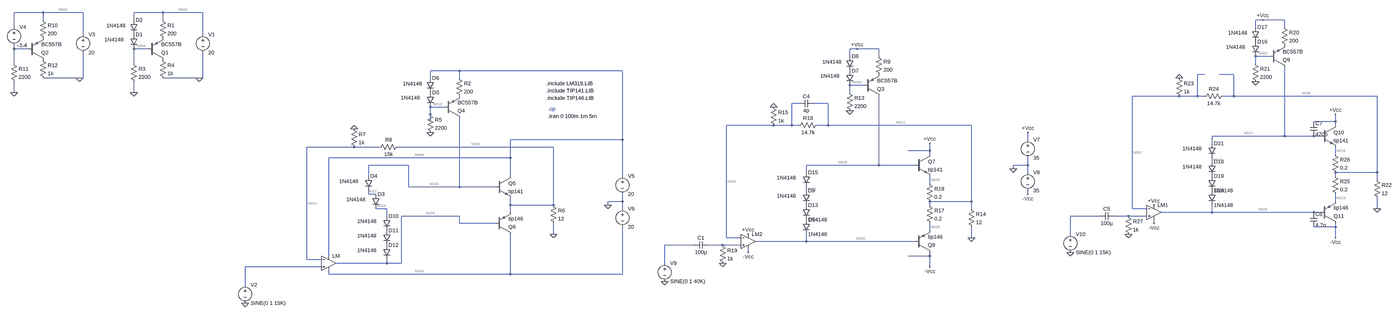
[diagram p0: schematic circuito_final.asc, whole sheet]
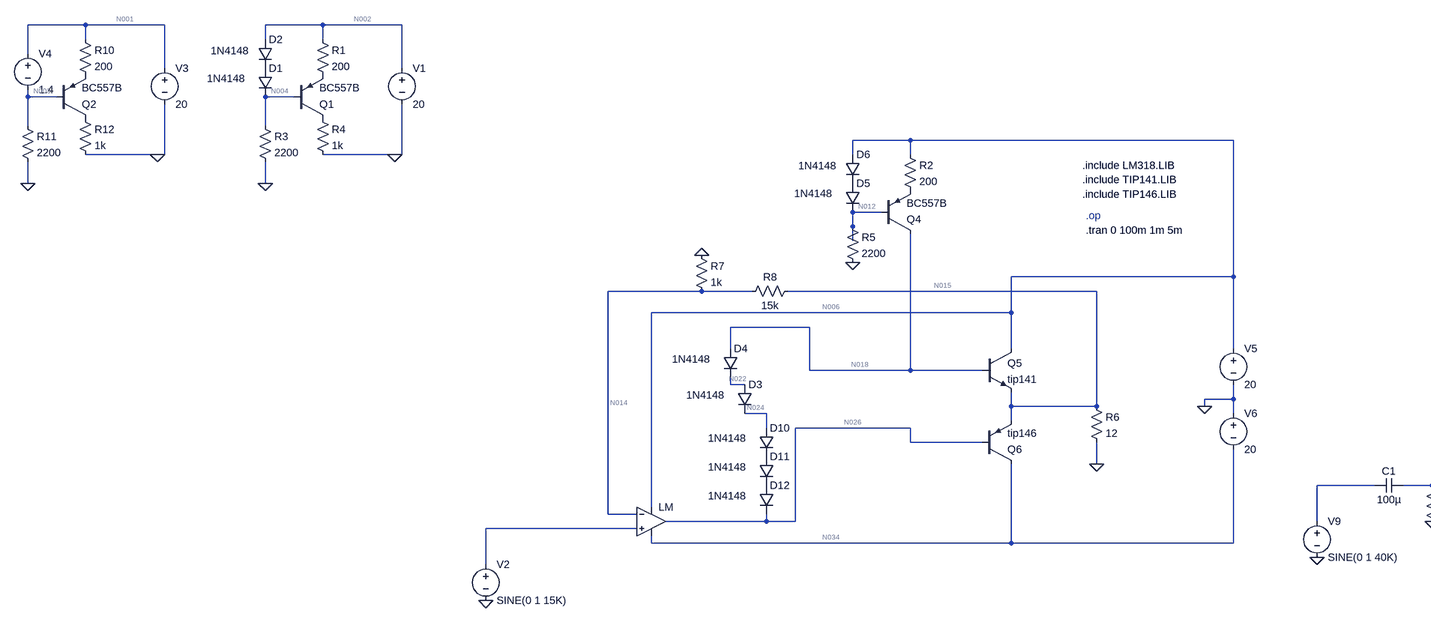
[diagram p1: schematic circuito_final.asc, part, row 1 of 1, column 1 of 2]
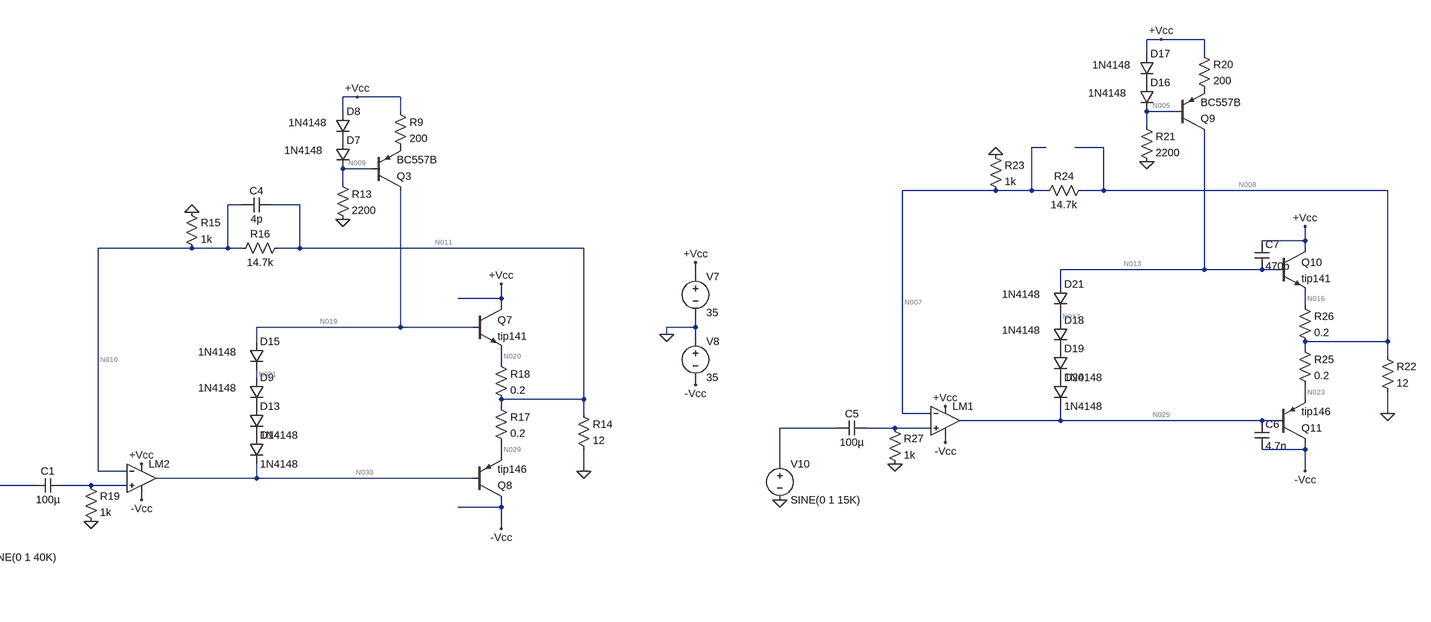
[diagram p2: schematic circuito_final.asc, part, row 1 of 1, column 2 of 2]
circuito_final.asc, the LTspice schematic file:
Version 4
SHEET 1 3348 680
WIRE -3168 -688 -3296 -688
WIRE -2992 -688 -3168 -688
WIRE -2640 -688 -2768 -688
WIRE -2464 -688 -2640 -688
WIRE -3168 -656 -3168 -688
WIRE -2768 -656 -2768 -688
WIRE -2640 -656 -2640 -688
WIRE 2768 -656 2736 -656
WIRE 2864 -656 2768 -656
WIRE -3296 -624 -3296 -688
WIRE 2736 -624 2736 -656
WIRE 2864 -624 2864 -656
WIRE -2992 -592 -2992 -688
WIRE -2464 -592 -2464 -688
WIRE -3296 -528 -3296 -544
WIRE -3232 -528 -3296 -528
WIRE -2704 -528 -2768 -528
WIRE 832 -528 800 -528
WIRE 928 -528 832 -528
WIRE 800 -496 800 -528
WIRE 928 -496 928 -528
WIRE 2800 -496 2736 -496
WIRE -3296 -464 -3296 -528
WIRE -2768 -464 -2768 -528
WIRE 2736 -464 2736 -496
WIRE -1072 -432 -1200 -432
WIRE -352 -432 -1072 -432
WIRE 2512 -416 2480 -416
WIRE 2640 -416 2576 -416
WIRE -3008 -400 -3168 -400
WIRE -2992 -400 -2992 -512
WIRE -2992 -400 -3008 -400
WIRE -2480 -400 -2640 -400
WIRE -2464 -400 -2464 -512
WIRE -2464 -400 -2480 -400
WIRE -1200 -400 -1200 -432
WIRE -1072 -400 -1072 -432
WIRE 864 -368 800 -368
WIRE -3296 -336 -3296 -384
WIRE -2768 -336 -2768 -384
WIRE 800 -336 800 -368
WIRE 2400 -320 2192 -320
WIRE 2480 -320 2480 -416
WIRE 2480 -320 2400 -320
WIRE 2512 -320 2480 -320
WIRE 2640 -320 2640 -416
WIRE 2640 -320 2592 -320
WIRE 3280 -320 2640 -320
WIRE 576 -288 544 -288
WIRE 704 -288 640 -288
WIRE -1136 -272 -1200 -272
WIRE -1200 -240 -1200 -272
WIRE -1200 -208 -1200 -240
WIRE 3088 -208 3088 -240
WIRE 3088 -208 2992 -208
WIRE 464 -192 256 -192
WIRE 544 -192 544 -288
WIRE 544 -192 464 -192
WIRE 576 -192 544 -192
WIRE 704 -192 704 -288
WIRE 704 -192 656 -192
WIRE 1344 -192 704 -192
WIRE 3088 -192 3088 -208
WIRE 2864 -144 2864 -448
WIRE 2864 -144 2544 -144
WIRE 2992 -144 2864 -144
WIRE 3024 -144 2992 -144
WIRE -352 -128 -352 -432
WIRE -352 -128 -848 -128
WIRE 1664 -128 1664 -160
WIRE 2544 -112 2544 -144
WIRE -1536 -96 -1744 -96
WIRE -1424 -96 -1536 -96
WIRE -656 -96 -1344 -96
WIRE 1152 -80 1152 -112
WIRE 1152 -80 1056 -80
WIRE 1152 -64 1152 -80
WIRE 3088 -64 3088 -96
WIRE -848 -48 -848 -128
WIRE -848 -48 -1648 -48
WIRE 2544 -32 2544 -48
WIRE -1296 -16 -1472 -16
WIRE 928 -16 928 -320
WIRE 928 -16 608 -16
WIRE 1088 -16 928 -16
WIRE 1664 -16 1664 -48
WIRE 1664 -16 1600 -16
WIRE 1600 0 1600 -16
WIRE 608 16 608 -16
WIRE 1664 16 1664 -16
WIRE 3280 16 3280 -320
WIRE 3280 16 3088 16
WIRE -1472 32 -1472 -16
WIRE -848 32 -848 -48
WIRE -352 32 -352 -128
WIRE 3088 32 3088 16
WIRE 3280 48 3280 16
WIRE 1152 64 1152 32
WIRE -1296 80 -1296 -16
WIRE -1072 80 -1072 -224
WIRE -1072 80 -1296 80
WIRE -912 80 -1072 80
WIRE 608 96 608 80
WIRE -1472 112 -1472 96
WIRE -1440 112 -1472 112
WIRE 1664 112 1664 96
WIRE -352 144 -352 112
WIRE -352 144 -416 144
WIRE 1344 144 1344 -192
WIRE 1344 144 1152 144
WIRE 3088 144 3088 112
WIRE -848 160 -848 128
WIRE -656 160 -656 -96
WIRE -656 160 -848 160
WIRE -416 160 -416 144
WIRE 1152 160 1152 144
WIRE -1392 176 -1440 176
WIRE -352 176 -352 144
WIRE 1344 176 1344 144
WIRE 2192 176 2192 -320
WIRE 2256 176 2192 176
WIRE 3280 176 3280 128
WIRE -848 192 -848 160
WIRE 2544 192 2544 160
WIRE 2544 192 2320 192
WIRE 2992 192 2544 192
WIRE 3024 192 2992 192
WIRE -1392 208 -1392 176
WIRE -1072 208 -1328 208
WIRE 2048 208 1920 208
WIRE 2176 208 2112 208
WIRE 2256 208 2176 208
WIRE -1072 240 -1072 208
WIRE -912 240 -1072 240
WIRE 2288 240 2288 224
WIRE 3088 256 3088 240
WIRE 3088 256 2992 256
WIRE 1152 272 1152 240
WIRE -656 288 -656 240
WIRE 1920 288 1920 208
WIRE 256 304 256 -192
WIRE 320 304 256 304
WIRE 1344 304 1344 256
WIRE 3088 304 3088 256
WIRE 608 320 608 288
WIRE 608 320 384 320
WIRE 1088 320 608 320
WIRE 112 336 -16 336
WIRE 240 336 176 336
WIRE 320 336 240 336
WIRE 352 368 352 352
WIRE -1648 384 -1648 -48
WIRE 1152 384 1152 368
WIRE 1152 384 1056 384
WIRE -1744 400 -1744 -96
WIRE -1680 400 -1744 400
WIRE -1392 416 -1392 400
WIRE -1392 416 -1616 416
WIRE -1328 416 -1328 208
WIRE -1328 416 -1392 416
WIRE -16 416 -16 336
WIRE -1680 432 -2016 432
WIRE 1152 432 1152 384
WIRE -1648 464 -1648 448
WIRE -848 464 -848 288
WIRE -848 464 -1648 464
WIRE -352 464 -352 256
WIRE -352 464 -848 464
WIRE -2016 512 -2016 432
FLAG -1200 -160 0
FLAG -416 160 0
FLAG -656 288 0
FLAG -2768 -336 0
FLAG -2480 -400 0
FLAG -1536 -176 0
FLAG -2016 592 0
FLAG -3296 -336 0
FLAG -3008 -400 0
FLAG 1600 0 0
FLAG 1664 -160 +Vcc
FLAG 1664 112 -Vcc
FLAG 2736 -384 0
FLAG 3280 176 0
FLAG 2400 -400 0
FLAG 1920 368 0
FLAG 2768 -656 +Vcc
FLAG 2288 240 -Vcc
FLAG 3088 -240 +Vcc
FLAG 2288 160 +Vcc
FLAG 3088 304 -Vcc
FLAG 2176 288 0
FLAG 800 -256 0
FLAG 1344 304 0
FLAG 464 -272 0
FLAG -16 496 0
FLAG 832 -528 +Vcc
FLAG 352 368 -Vcc
FLAG 1152 -112 +Vcc
FLAG 352 288 +Vcc
FLAG 1152 432 -Vcc
FLAG 240 416 0
DATAFLAG -848 160 ""
DATAFLAG -848 160 ""
DATAFLAG -1056 80 ""
DATAFLAG -1040 240 ""
DATAFLAG 3280 -128 ""
DATAFLAG 2768 -144 ""
DATAFLAG 2800 192 ""
DATAFLAG 1344 0 ""
DATAFLAG 832 -16 ""
DATAFLAG 864 320 ""
SYMBOL diode -1216 -336 R0
WINDOW 3 -114 23 Left 2
SYMATTR Value 1N4148
SYMATTR InstName D5
SYMBOL diode -1216 -400 R0
WINDOW 3 -105 25 Left 2
SYMATTR Value 1N4148
SYMATTR InstName D6
SYMBOL res -1088 -416 R0
SYMATTR InstName R2
SYMATTR Value 200
SYMBOL res -1216 -256 R0
SYMATTR InstName R5
SYMATTR Value 2200
SYMBOL pnp -1136 -224 M180
SYMATTR InstName Q4
SYMATTR Value BC557B
SYMBOL npn -912 32 R0
SYMATTR InstName Q5
SYMATTR Value tip141
SYMATTR Prefix X
SYMBOL pnp -912 288 M180
SYMATTR InstName Q6
SYMATTR Value tip146
SYMATTR Prefix X
SYMBOL voltage -352 16 R0
WINDOW 123 0 0 Left 0
WINDOW 39 0 0 Left 0
SYMATTR InstName V5
SYMATTR Value 20
SYMBOL voltage -352 160 R0
WINDOW 123 0 0 Left 0
WINDOW 39 0 0 Left 0
SYMATTR InstName V6
SYMATTR Value 20
SYMBOL res -672 144 R0
SYMATTR InstName R6
SYMATTR Value 12
SYMBOL diode -1408 208 R0
WINDOW 3 -114 23 Left 2
SYMATTR Value 1N4148
SYMATTR InstName D10
SYMBOL diode -1408 272 R0
WINDOW 3 -114 23 Left 2
SYMATTR Value 1N4148
SYMATTR InstName D11
SYMBOL diode -1408 336 R0
WINDOW 3 -114 23 Left 2
SYMATTR Value 1N4148
SYMATTR InstName D12
SYMBOL diode -2784 -592 R0
WINDOW 3 -114 23 Left 2
SYMATTR Value 1N4148
SYMATTR InstName D1
SYMBOL diode -2784 -656 R0
WINDOW 3 -105 25 Left 2
SYMATTR Value 1N4148
SYMATTR InstName D2
SYMBOL res -2656 -672 R0
SYMATTR InstName R1
SYMATTR Value 200
SYMBOL res -2784 -480 R0
SYMATTR InstName R3
SYMATTR Value 2200
SYMBOL pnp -2704 -480 M180
SYMATTR InstName Q1
SYMATTR Value BC557B
SYMBOL voltage -2464 -608 R0
WINDOW 123 0 0 Left 0
WINDOW 39 0 0 Left 0
SYMATTR InstName V1
SYMATTR Value 20
SYMBOL res -2656 -496 R0
SYMATTR InstName R4
SYMATTR Value 1k
SYMBOL res -1552 -192 R0
SYMATTR InstName R7
SYMATTR Value 1k
SYMBOL res -1328 -112 R90
WINDOW 0 0 56 VBottom 2
WINDOW 3 32 56 VTop 2
SYMATTR InstName R8
SYMATTR Value 15k
SYMBOL voltage -2016 496 R0
WINDOW 123 0 0 Left 0
WINDOW 39 0 0 Left 0
SYMATTR InstName V2
SYMATTR Value SINE(0 1 15K)
SYMBOL diode -1456 112 R0
WINDOW 3 -114 23 Left 2
SYMATTR Value 1N4148
SYMATTR InstName D3
SYMBOL diode -1488 32 R0
WINDOW 3 -114 23 Left 2
SYMATTR Value 1N4148
SYMATTR InstName D4
SYMBOL res -3184 -672 R0
SYMATTR InstName R10
SYMATTR Value 200
SYMBOL res -3312 -480 R0
SYMATTR InstName R11
SYMATTR Value 2200
SYMBOL pnp -3232 -480 M180
SYMATTR InstName Q2
SYMATTR Value BC557B
SYMBOL voltage -2992 -608 R0
WINDOW 123 0 0 Left 0
WINDOW 39 0 0 Left 0
SYMATTR InstName V3
SYMATTR Value 20
SYMBOL res -3184 -496 R0
SYMATTR InstName R12
SYMATTR Value 1k
SYMBOL voltage -3296 -640 R0
WINDOW 123 0 0 Left 0
WINDOW 39 0 0 Left 0
SYMATTR InstName V4
SYMATTR Value 1.4
SYMBOL OpAmps\\UniversalOpAmp2 -1648 416 R0
SYMATTR InstName LM
SYMBOL voltage 1664 -144 R0
WINDOW 123 0 0 Left 0
WINDOW 39 0 0 Left 0
SYMATTR InstName V7
SYMATTR Value 35
SYMBOL voltage 1664 0 R0
WINDOW 123 0 0 Left 0
WINDOW 39 0 0 Left 0
SYMATTR InstName V8
SYMATTR Value 35
SYMBOL diode 2720 -560 R0
WINDOW 3 -114 23 Left 2
SYMATTR Value 1N4148
SYMATTR InstName D16
SYMBOL diode 2720 -624 R0
WINDOW 3 -105 25 Left 2
SYMATTR Value 1N4148
SYMATTR InstName D17
SYMBOL res 2848 -640 R0
SYMATTR InstName R20
SYMATTR Value 200
SYMBOL res 2720 -480 R0
SYMATTR InstName R21
SYMATTR Value 2200
SYMBOL pnp 2800 -448 M180
SYMATTR InstName Q9
SYMATTR Value BC557B
SYMBOL npn 3024 -192 R0
SYMATTR InstName Q10
SYMATTR Value tip141
SYMATTR Prefix X
SYMBOL pnp 3024 240 M180
SYMATTR InstName Q11
SYMATTR Value tip146
SYMATTR Prefix X
SYMBOL res 3264 32 R0
SYMATTR InstName R22
SYMATTR Value 12
SYMBOL diode 2528 -32 R0
WINDOW 3 -114 23 Left 2
SYMATTR Value 1N4148
SYMATTR InstName D18
SYMBOL diode 2528 32 R0
SYMATTR Value 1N4148
SYMATTR InstName D19
SYMBOL diode 2528 96 R0
SYMATTR Value 1N4148
SYMATTR InstName D20
SYMBOL res 2384 -416 R0
SYMATTR InstName R23
SYMATTR Value 1k
SYMBOL res 2608 -336 R90
WINDOW 0 0 56 VBottom 2
WINDOW 3 32 56 VTop 2
SYMATTR InstName R24
SYMATTR Value 14.7k
SYMBOL voltage 1920 272 R0
WINDOW 123 0 0 Left 0
WINDOW 39 0 0 Left 0
SYMATTR InstName V10
SYMATTR Value SINE(0 1 15K)
SYMBOL OpAmps\\UniversalOpAmp2 2288 192 R0
SYMATTR InstName LM1
SYMBOL diode 2528 -112 R0
WINDOW 3 -114 23 Left 2
SYMATTR Value 1N4148
SYMATTR InstName D21
SYMBOL res 3072 16 R0
SYMATTR InstName R25
SYMATTR Value 0.2
SYMBOL res 3072 -80 R0
SYMATTR InstName R26
SYMATTR Value 0.2
SYMBOL res 2160 192 R0
SYMATTR InstName R27
SYMATTR Value 1k
SYMBOL cap 2112 192 R90
WINDOW 0 0 32 VBottom 2
WINDOW 3 32 32 VTop 2
SYMATTR InstName C5
SYMATTR Value 100µ
SYMBOL cap 2976 192 R0
SYMATTR InstName C6
SYMATTR Value 4.7n
SYMBOL cap 2976 -208 R0
SYMATTR InstName C7
SYMATTR Value 470p
SYMBOL diode 784 -432 R0
WINDOW 3 -114 23 Left 2
SYMATTR Value 1N4148
SYMATTR InstName D7
SYMBOL diode 784 -496 R0
WINDOW 3 -105 25 Left 2
SYMATTR Value 1N4148
SYMATTR InstName D8
SYMBOL res 912 -512 R0
SYMATTR InstName R9
SYMATTR Value 200
SYMBOL res 784 -352 R0
SYMATTR InstName R13
SYMATTR Value 2200
SYMBOL pnp 864 -320 M180
SYMATTR InstName Q3
SYMATTR Value BC557B
SYMBOL npn 1088 -64 R0
SYMATTR InstName Q7
SYMATTR Value tip141
SYMATTR Prefix X
SYMBOL pnp 1088 368 M180
SYMATTR InstName Q8
SYMATTR Value tip146
SYMATTR Prefix X
SYMBOL res 1328 160 R0
SYMATTR InstName R14
SYMATTR Value 12
SYMBOL diode 592 96 R0
WINDOW 3 -114 23 Left 2
SYMATTR Value 1N4148
SYMATTR InstName D9
SYMBOL diode 592 160 R0
SYMATTR Value 1N4148
SYMATTR InstName D13
SYMBOL diode 592 224 R0
SYMATTR Value 1N4148
SYMATTR InstName D14
SYMBOL res 448 -288 R0
SYMATTR InstName R15
SYMATTR Value 1k
SYMBOL res 672 -208 R90
WINDOW 0 0 56 VBottom 2
WINDOW 3 32 56 VTop 2
SYMATTR InstName R16
SYMATTR Value 14.7k
SYMBOL voltage -16 400 R0
WINDOW 123 0 0 Left 0
WINDOW 39 0 0 Left 0
SYMATTR InstName V9
SYMATTR Value SINE(0 1 40K)
SYMBOL OpAmps\\UniversalOpAmp2 352 320 R0
SYMATTR InstName LM2
SYMBOL diode 592 16 R0
WINDOW 3 -114 23 Left 2
SYMATTR Value 1N4148
SYMATTR InstName D15
SYMBOL res 1136 144 R0
SYMATTR InstName R17
SYMATTR Value 0.2
SYMBOL res 1136 48 R0
SYMATTR InstName R18
SYMATTR Value 0.2
SYMBOL res 224 320 R0
SYMATTR InstName R19
SYMATTR Value 1k
SYMBOL cap 176 320 R90
WINDOW 0 0 32 VBottom 2
WINDOW 3 32 32 VTop 2
SYMATTR InstName C1
SYMATTR Value 100µ
SYMBOL cap 640 -304 R90
WINDOW 0 0 32 VBottom 2
WINDOW 3 32 32 VTop 2
SYMATTR InstName C4
SYMATTR Value 4p
TEXT -680 -232 Left 2 !.tran 0 100m 1m 5m
TEXT -688 -344 Left 2 !.include TIP141.LIB
TEXT -688 -312 Left 2 !.include TIP146.LIB
TEXT -688 -376 Left 2 !.include LM318.LIB
TEXT -680 -264 Left 2 ;.op

The netlist it stands for:
* circuito_final.asc
D5 P001 N012 1N4148
D6 N006 P001 1N4148
R2 N006 P002 200
R5 N012 0 2200
Q4 N018 N012 P002 0 BC557B
XQ5 N006 N018 N015 tip141  ; pins C B E
XQ6 N034 N026 N015 tip146  ; pins C B E
V5 N006 0 20
V6 0 N034 20
R6 N015 0 12
D10 N024 P003 1N4148
D11 P003 P004 1N4148
D12 P004 N026 1N4148
D1 P005 N004 1N4148
D2 N002 P005 1N4148
R1 N002 P006 200
R3 N004 0 2200
Q1 P007 N004 P006 0 BC557B
V1 N002 0 20
R4 P007 0 1k
R7 0 N014 1k
R8 N015 N014 15k
V2 N033 0 SINE(0 1 15K)
D3 N022 N024 1N4148
D4 N018 N022 1N4148
R10 N001 P008 200
R11 N003 0 2200
Q2 P009 N003 P008 0 BC557B
V3 N001 0 20
R12 P009 0 1k
V4 N001 N003 1.4
XLM N033 N014 N006 N034 N026 level2 Avol=1Meg GBW=10Meg Slew=10Meg Ilimit=25m Rail=0 Vos=0 En=0 Enk=0 In=0 Ink=0 Rin=500Meg  ; pins In+ In- V+ V- OUT
V7 +Vcc 0 35
V8 0 -Vcc 35
D16 P010 N005 1N4148
D17 +Vcc P010 1N4148
R20 +Vcc P011 200
R21 N005 0 2200
Q9 N013 N005 P011 0 BC557B
XQ10 +Vcc N013 N016 tip141  ; pins C B E
XQ11 -Vcc N025 N023 tip146  ; pins C B E
R22 N008 0 12
D18 N017 P012 1N4148
D19 P012 P013 1N4148
D20 P013 N025 1N4148
R23 0 N007 1k
R24 N008 N007 14.7k
V10 N027 0 SINE(0 1 15K)
XLM1 N028 N007 +Vcc -Vcc N025 level2 Avol=1Meg GBW=10Meg Slew=10Meg Ilimit=25m Rail=0 Vos=0 En=0 Enk=0 In=0 Ink=0 Rin=500Meg  ; pins In+ In- V+ V- OUT
D21 N013 N017 1N4148
R25 N008 N023 0.2
R26 N016 N008 0.2
R27 N028 0 1k
C5 N028 N027 100µ
C6 N025 -Vcc 4.7n
C7 +Vcc N013 470p
D7 P014 N009 1N4148
D8 +Vcc P014 1N4148
R9 +Vcc P015 200
R13 N009 0 2200
Q3 N019 N009 P015 0 BC557B
XQ7 +Vcc N019 N020 tip141  ; pins C B E
XQ8 -Vcc N030 N029 tip146  ; pins C B E
R14 N011 0 12
D9 N021 P016 1N4148
D13 P016 P017 1N4148
D14 P017 N030 1N4148
R15 0 N010 1k
R16 N011 N010 14.7k
V9 N031 0 SINE(0 1 40K)
XLM2 N032 N010 +Vcc -Vcc N030 level2 Avol=1Meg GBW=10Meg Slew=10Meg Ilimit=25m Rail=0 Vos=0 En=0 Enk=0 In=0 Ink=0 Rin=500Meg  ; pins In+ In- V+ V- OUT
D15 N019 N021 1N4148
R17 N011 N029 0.2
R18 N020 N011 0.2
R19 N032 0 1k
C1 N032 N031 100µ
C4 N011 N010 4p
.model D D
.lib standard.dio
.model NPN NPN
.model PNP PNP
.lib standard.bjt
.tran 0 100m 1m 5m
.include TIP141.LIB
.include TIP146.LIB
.include LM318.LIB
* .op
.lib UniversalOpAmp2.lib
.backanno
.end

* Results of the author's LTspice run, read from the files saved beside the schematic
* Operating Point, zero values left out:
*   V(p001) = 19.31 V
*   V(n012) = 18.63 V
*   V(n006) = 20 V
*   V(p002) = 19.28 V
*   V(n018) = 1.656 V
*   V(n015) = 24.92 µV
*   V(n034) = -20 V
*   V(n026) = -1.538 V
*   V(n024) = 378.8 mV
*   V(p003) = -260.1 mV
*   V(p004) = -898.9 mV
*   V(p005) = 19.31 V
*   V(n004) = 18.63 V
*   V(n002) = 20 V
*   V(p006) = 19.28 V
*   V(p007) = 3.611 V
*   V(n014) = 1.558 µV
*   V(n022) = 1.018 V
*   V(n001) = 20 V
*   V(p008) = 19.25 V
*   V(n003) = 18.6 V
*   V(p009) = 3.747 V
*   V(+vcc) = 35 V
*   V(-vcc) = -35 V
*   V(p010) = 34.28 V
*   V(n005) = 33.57 V
*   V(p011) = 34.21 V
*   V(n013) = 1.346 V
*   V(n016) = 1.896 mV
*   V(n025) = -1.233 V
*   V(n023) = -1.857 mV
*   V(n008) = 19.57 µV
*   V(n017) = 701 mV
*   V(p012) = 56.14 mV
*   V(p013) = -588.7 mV
*   V(n007) = 1.247 µV
*   V(p014) = 34.28 V
*   V(n009) = 33.57 V
*   V(p015) = 34.21 V
*   V(n019) = 1.346 V
*   V(n020) = 1.896 mV
*   V(n030) = -1.233 V
*   V(n029) = -1.857 mV
*   V(n011) = 19.57 µV
*   V(n021) = 701 mV
*   V(p016) = 56.14 mV
*   V(p017) = -588.7 mV
*   V(n010) = 1.247 µV
*   Ic(Q4) = -3.618 mA
*   Ib(Q4) = -6.185 µA
*   Ie(Q4) = 3.624 mA
*   Ic(Q1) = -3.611 mA
*   Ib(Q1) = -6.516 µA
*   Ie(Q1) = 3.617 mA
*   Ic(Q2) = -3.747 mA
*   Ib(Q2) = -6.799 µA
*   Ie(Q2) = 3.754 mA
*   Ic(Q9) = -3.957 mA
*   Ib(Q9) = -4.799 µA
*   Ie(Q9) = 3.962 mA
*   Ic(Q3) = -3.957 mA
*   Ib(Q3) = -4.799 µA
*   Ie(Q3) = 3.962 mA
*   I(D5) = 8.461 mA
*   I(D6) = 8.461 mA
*   I(D10) = 3.21 mA
*   I(D11) = 3.21 mA
*   I(D12) = 3.21 mA
*   I(D1) = 8.461 mA
*   I(D2) = 8.461 mA
*   I(D3) = 3.21 mA
*   I(D4) = 3.21 mA
*   I(D16) = 15.25 mA
*   I(D17) = 15.25 mA
*   I(D18) = 3.642 mA
*   I(D19) = 3.642 mA
*   I(D20) = 3.642 mA
*   I(D21) = 3.642 mA
*   I(D7) = 15.25 mA
*   I(D8) = 15.25 mA
*   I(D9) = 3.642 mA
*   I(D13) = 3.642 mA
*   I(D14) = 3.642 mA
*   I(D15) = 3.642 mA
*   I(R2) = 3.624 mA
*   I(R5) = 8.468 mA
*   I(R6) = 2.077 µA
*   I(R1) = 3.617 mA
*   I(R3) = 8.468 mA
*   I(R4) = 3.611 mA
*   I(R7) = -1.558 nA
*   I(R8) = 1.558 nA
*   I(R10) = 3.754 mA
*   I(R11) = 8.455 mA
*   I(R12) = 3.747 mA
*   I(R20) = 3.962 mA
*   I(R21) = 15.26 mA
*   I(R22) = 1.631 µA
*   I(R23) = -1.247 nA
*   I(R24) = 1.247 nA
*   I(R25) = 9.381 mA
*   I(R26) = 9.382 mA
*   I(R9) = 3.962 mA
*   I(R13) = 15.26 mA
*   I(R14) = 1.631 µA
*   I(R15) = -1.247 nA
*   I(R16) = 1.247 nA
*   I(R17) = 9.381 mA
*   I(R18) = 9.382 mA
*   I(V5) = -29.27 mA
*   I(V6) = -20.8 mA
*   I(V1) = -12.08 mA
*   I(V3) = -12.2 mA
*   I(V4) = 8.448 mA
*   I(V7) = -60.66 mA
*   I(V8) = -30.14 mA